# EAGLE design OSO-SCAP-A1-02 SAMD51 Sensor Cap (EAGLE 9.4.2)

## Sheet 1 of 2
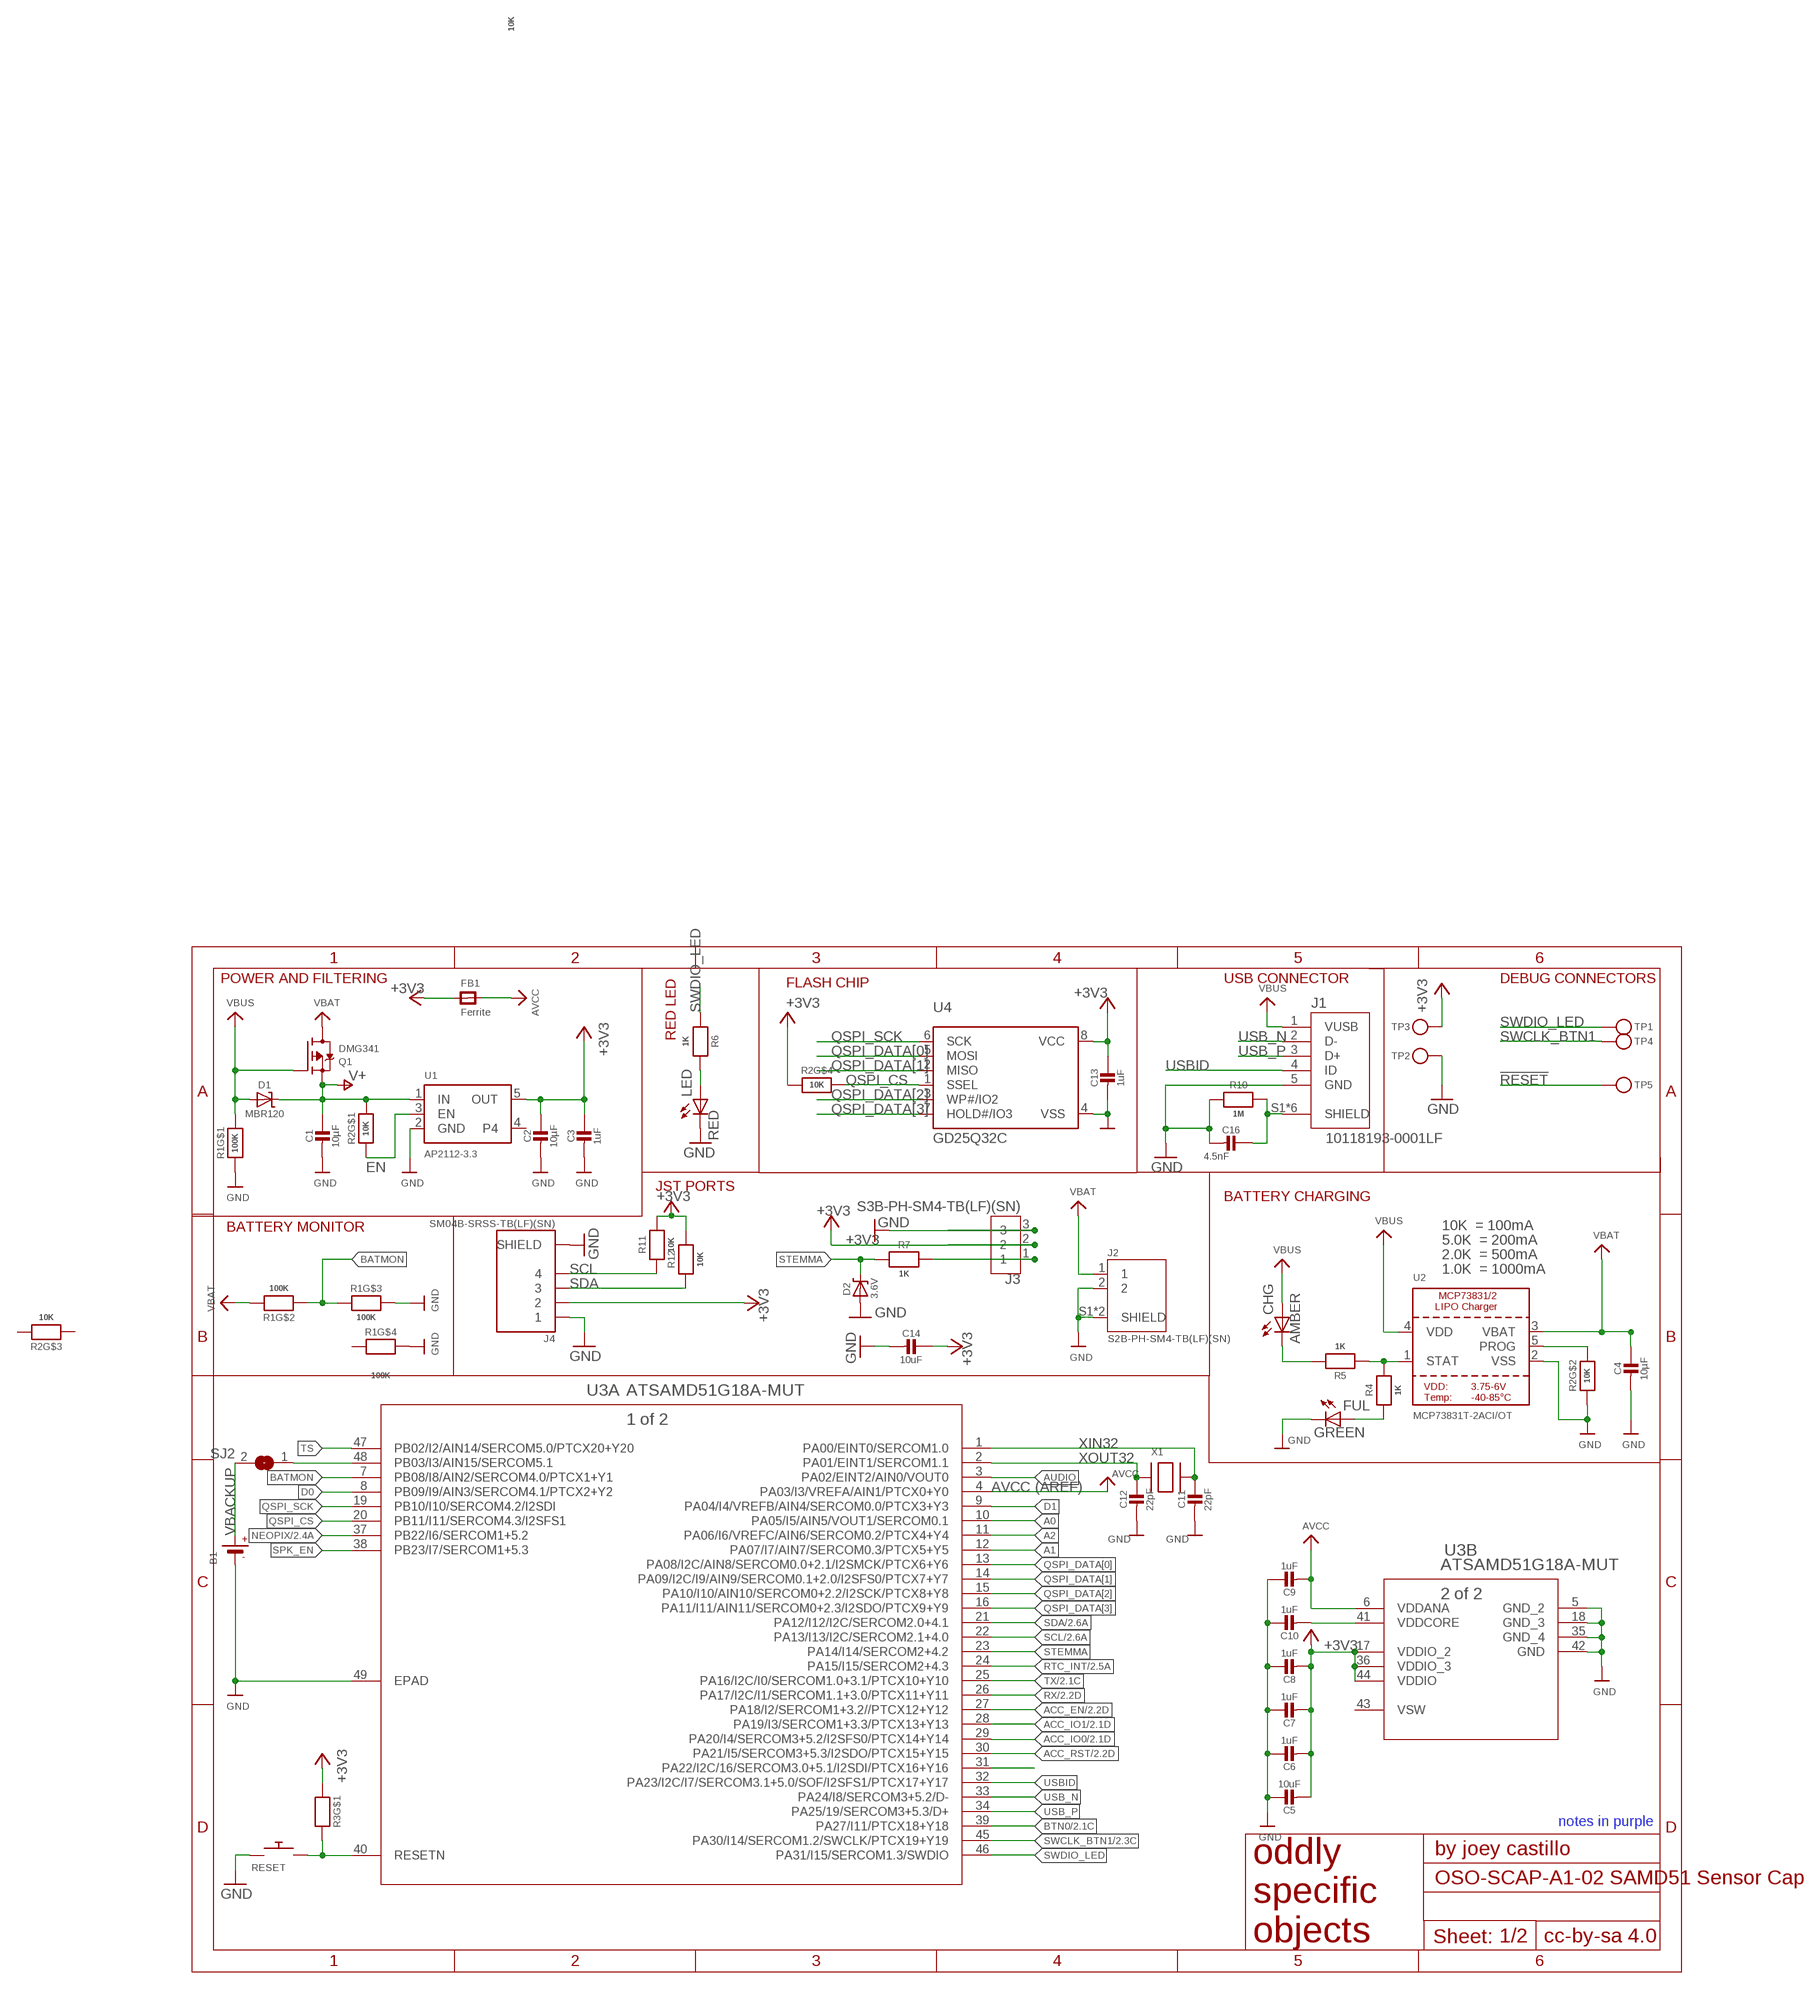
[diagram p0: schematic, sheet 1]

### Parts
B1  CR1220  BATTERYCR1220_2  [CR1220-2]
C1  10µF  CAP_CERAMIC0805-NOOUTLINE  [0805-NO]
C2  10µF  CAP_CERAMIC0805-NOOUTLINE  [0805-NO]
C3  1uF  CAP_CERAMIC0603_NO  [0603-NO]
C4  10µF  CAP_CERAMIC0805-NOOUTLINE  [0805-NO]
C5  10uF  CAP_CERAMIC0805_10MGAP  [0805_10MGAP]
C6  1uF  CAP_CERAMIC0603_NO  [0603-NO]
C7  1uF  CAP_CERAMIC0603_NO  [0603-NO]
C8  1uF  CAP_CERAMIC0603_NO  [0603-NO]
C9  1uF  CAP_CERAMIC0603_NO  [0603-NO]
C10  1uF  CAP_CERAMIC0603_NO  [0603-NO]
C11  22pF  CAP_CERAMIC0603_NO  [0603-NO]
C12  22pF  CAP_CERAMIC0603_NO  [0603-NO]
C13  1uF  CAP_CERAMIC0603_NO  [0603-NO]
C14  10uF  CAP_CERAMIC0805-NOOUTLINE  [0805-NO]
C16  4.5nF  CAP_CERAMIC0603_NO  [0603-NO]
CHG  AMBER  LEDCHIPLED_0603  [CHIPLED_0603]
D1  MBR120  DIODE-SCHOTTKYSOD-123  [SOD-123]
D2  3.6V  DIODE-ZENERSOD123  [SOD-123]
FB1  Ferrite  FERRITE_0805MP  [_0805MP]
FUL  GREEN  LEDCHIPLED_0603  [CHIPLED_0603]
J1  10118193-0001LF  [FCI_10118193-0001LF]
J2  S2B-PH-SM4-TB(LF)(SN)  [JST_S2B-PH-SM4-TB(LF)(SN)]
J3  S3B-PH-SM4-TB(LF)(SN)  [JST_S3B-PH-SM4-TB(LF)(SN)]
J4  SM04B-SRSS-TB(LF)(SN)  [JST_SM04B-SRSS-TB(LF)(SN)]
LED  RED  LEDCHIPLED_0603  [CHIPLED_0603]
Q1  DMG341  MOSFET-P  [SOT23-R]
R1  100K  EXB-V8V103JV-GOOD  [EXBV8V]
R2  10K  EXB-V8V103JV-GOOD  [EXBV8V]
R3  10K  EXB-V8V103JV-GOOD  [EXBV8V]
R4  1K  RESISTOR_0603_NOOUT  [0603-NO]
R5  1K  RESISTOR_0603_NOOUT  [0603-NO]
R6  1K  RESISTOR_0603_NOOUT  [0603-NO]
R7  1K  RESISTOR_0603_NOOUT  [0603-NO]
R10  1M  RESISTOR_0603_NOOUT  [0603-NO]
R11  10K  RESISTOR_0603_NOOUT  [0603-NO]
R12  10K  RESISTOR_0603_NOOUT  [0603-NO]
RESET  SWITCH_PUSHBUTTONC&K_KSS  [BTN_CK_KSS]
SJ2  SOLDERJUMPERREFLOW_NOPASTE  [SOLDERJUMPER_REFLOW_NOPASTE]
TP1  TESTPOINTROUND1.5MMNO  [TESTPOINT_ROUND_1.5MM_NO]
TP2  TESTPOINTROUND1.5MMNO  [TESTPOINT_ROUND_1.5MM_NO]
TP3  TESTPOINTROUND1.5MMNO  [TESTPOINT_ROUND_1.5MM_NO]
TP4  TESTPOINTROUND1.5MMNO  [TESTPOINT_ROUND_1.5MM_NO]
TP5  TESTPOINTROUND1.5MMNO  [TESTPOINT_ROUND_1.5MM_NO]
U1  AP2112-3.3  VREG_SOT23-5  [SOT23-5]
U2  MCP73831T-2ACI/OT  MCP73831/2  [SOT23-5]
U3  ATSAMD51G18A-MUT  [QFN48_7X7MC]
U4  GD25Q32C  MICROBUILDER_SPIFLASH_SOIC8  [MICROBUILDER_SOIC8_150MIL]
X1  XTAL-3.2X1.5  [XTAL3215]

### Nets
!RESET: R3.8 RESET.P$2 TP5.P$1 U3.40(A:RESETN)
+3V3 [power]: C2.1 C3.1 C5.2 C6.2 C7.2 C8.2 C13.1 C14.1 FB1.1 J3.2 J4.2 R2.4 R3.1 R11.2 R12.2 TP3.P$1 U1.5(OUT) U3.17(B:VDDIO_2) U3.36(B:VDDIO_3) U3.44(B:VDDIO) U4.8(VCC) ; also sheet 2
_STEMMA: J3.1 R7.1
_VBACKUP: SJ2.1 U3.48(A:PB03/I3/AIN15/SERCOM5.1)
A0: U3.10(A:PA05/I5/AIN5/VOUT1/SERCOM0.1) ; also sheet 2
A1: U3.12(A:PA07/I7/AIN7/SERCOM0.3/PTCX5+Y5) ; also sheet 2
A2: U3.11(A:PA06/I6/VREFC/AIN6/SERCOM0.2/PTCX4+Y4) ; also sheet 2
ACC_EN: U3.27(A:PA18/I2/SERCOM1+3.2//PTCX12+Y12) ; also sheet 2
ACC_IO0: U3.29(A:PA20/I4/SERCOM3+5.2/I2SFS0/PTCX14+Y14) ; also sheet 2
ACC_IO1: U3.28(A:PA19/I3/SERCOM1+3.3/PTCX13+Y13) ; also sheet 2
ACC_RST: U3.30(A:PA21/I5/SERCOM3+5.3/I2SDO/PTCX15+Y15) ; also sheet 2
AUDIO: U3.3(A:PA02/EINT2/AIN0/VOUT0) ; also sheet 2
AVCC: C9.2 FB1.2 U3.4(A:PA03/I3/VREFA/AIN1/PTCX0+Y0) U3.6(B:VDDANA) ; also sheet 2
BATMON: R1.2 R1.3 U3.7(A:PB08/I8/AIN2/SERCOM4.0/PTCX1+Y1)
BTN0: U3.39(A:PA27/I11/PTCX18+Y18) ; also sheet 2
D0: U3.8(A:PB09/I9/AIN3/SERCOM4.1/PTCX2+Y2) ; also sheet 2
D1: U3.9(A:PA04/I4/VREFB/AIN4/SERCOM0.0/PTCX3+Y3) ; also sheet 2
EN: R2.1 U1.3(EN) ; also sheet 2
GND [gnd]: B1.- C1.2 C2.2 C3.2 C4.2 C5.1 C6.1 C7.1 C8.1 C9.1 C10.1 C11.2 C12.2 C13.2 C14.2 C16.2 D2.A FUL.C J1.5(GND) J2.2 J2.S1(SHIELD) J2.S2(SHIELD) J3.3 J4.1 J4.S1(SHIELD) J4.S2(SHIELD) LED.C R1.1 R1.5 R1.6 R2.2 R10.2 RESET.P$1 TP2.P$1 U1.2(GND) U2.2(VSS) U3.5(B:GND_2) U3.18(B:GND_3) U3.35(B:GND_4) U3.42(B:GND) U3.49(A:EPAD) U4.4(VSS) ; also sheet 2
N$2: LED.A R6.2
N$5: U3.31(A:PA22/I2C/16/SERCOM3.0+5.1/I2SDI/PTCX16+Y16)
N$6: CHG.C R5.2
N$7: FUL.A R4.1
NEOPIX: U3.37(A:PB22/I6/SERCOM1+5.2) ; also sheet 2
PROG: R2.7 U2.5(PROG)
QSPI_CS: R2.5 U3.20(A:PB11/I11/SERCOM4.3/I2SFS1) U4.1(SSEL)
QSPI_DATA[0]: U3.13(A:PA08/I2C/AIN8/SERCOM0.0+2.1/I2SMCK/PTCX6+Y6) U4.5(MOSI)
QSPI_DATA[1]: U3.14(A:PA09/I2C/I9/AIN9/SERCOM0.1+2.0/I2SFS0/PTCX7+Y7) U4.2(MISO)
QSPI_DATA[2]: U3.15(A:PA10/I10/AIN10/SERCOM0+2.2/I2SCK/PTCX8+Y8) U4.3(WP#/IO2)
QSPI_DATA[3]: U3.16(A:PA11/I11/AIN11/SERCOM0+2.3/I2SDO/PTCX9+Y9) U4.7(HOLD#/IO3)
QSPI_SCK: U3.19(A:PB10/I10/SERCOM4.2/I2SDI) U4.6(SCK)
RTC_INT: U3.24(A:PA15/I15/SERCOM2+4.3) ; also sheet 2
RX: U3.26(A:PA17/I2C/I1/SERCOM1.1+3.0/PTCX11+Y11) ; also sheet 2
SCL: J4.4 R11.1 U3.22(A:PA13/I13/I2C/SERCOM2.1+4.0) ; also sheet 2
SDA: J4.3 R12.1 U3.21(A:PA12/I12/I2C/SERCOM2.0+4.1) ; also sheet 2
SHIELD [gnd]: C16.1 J1.S1(SHIELD) J1.S2(SHIELD) J1.S3(SHIELD) J1.S4(SHIELD) J1.S5(SHIELD) J1.S6(SHIELD) R10.1
SPK_EN: U3.38(A:PB23/I7/SERCOM1+5.3) ; also sheet 2
STAT: R4.2 R5.1 U2.1(STAT)
STEMMA: D2.C R7.2 U3.23(A:PA14/I14/SERCOM2+4.2)
SWCLK_BTN1: TP4.P$1 U3.45(A:PA30/I14/SERCOM1.2/SWCLK/PTCX19+Y19) ; also sheet 2
SWDIO_LED: R6.1 TP1.P$1 U3.46(A:PA31/I15/SERCOM1.3/SWDIO)
TS: U3.47(A:PB02/I2/AIN14/SERCOM5.0/PTCX20+Y20) ; also sheet 2
TX: U3.25(A:PA16/I2C/I0/SERCOM1.0+3.1/PTCX10+Y10) ; also sheet 2
USB_N: J1.2(D-) U3.33(A:PA24/I8/SERCOM3+5.2/D-)
USB_P: J1.3(D+) U3.34(A:PA25/19/SERCOM3+5.3/D+)
USBID: J1.4(ID) U3.32(A:PA23/I2C/I7/SERCOM3.1+5.0/SOF/I2SFS1/PTCX17+Y17)
V+ [power]: C1.1 D1.C Q1.2(S) R2.8 U1.1(IN) ; also sheet 2
VBACKUP: B1.+ SJ2.2 ; also sheet 2
VBAT [power]: C4.1 J2.1 Q1.3(D) R1.7 U2.3(VBAT)
VBUS [power]: CHG.A D1.A J1.1(VUSB) Q1.1(G) R1.8 U2.4(VDD)
VDDCORE: C10.2 U3.41(B:VDDCORE)
XIN32: C11.1 U3.1(A:PA00/EINT0/SERCOM1.0) X1.P$2
XOUT32: C12.1 U3.2(A:PA01/EINT1/SERCOM1.1) X1.P$1
Unconnected: R1.4 R2.3 R2.6 U1.4

### Notes on the sheet
- RED LED
- POWER AND FILTERING | USB CONNECTOR | DEBUG CONNECTORS
- FLASH CHIP
- JST PORTS
- BATTERY CHARGING
- BATTERY MONITOR | 10K  = 100mA
- 5.0K  = 200mA
- 2.0K  = 500mA
- 1.0K  = 1000mA
- (AREF)
- notes in purple

## Sheet 2 of 2
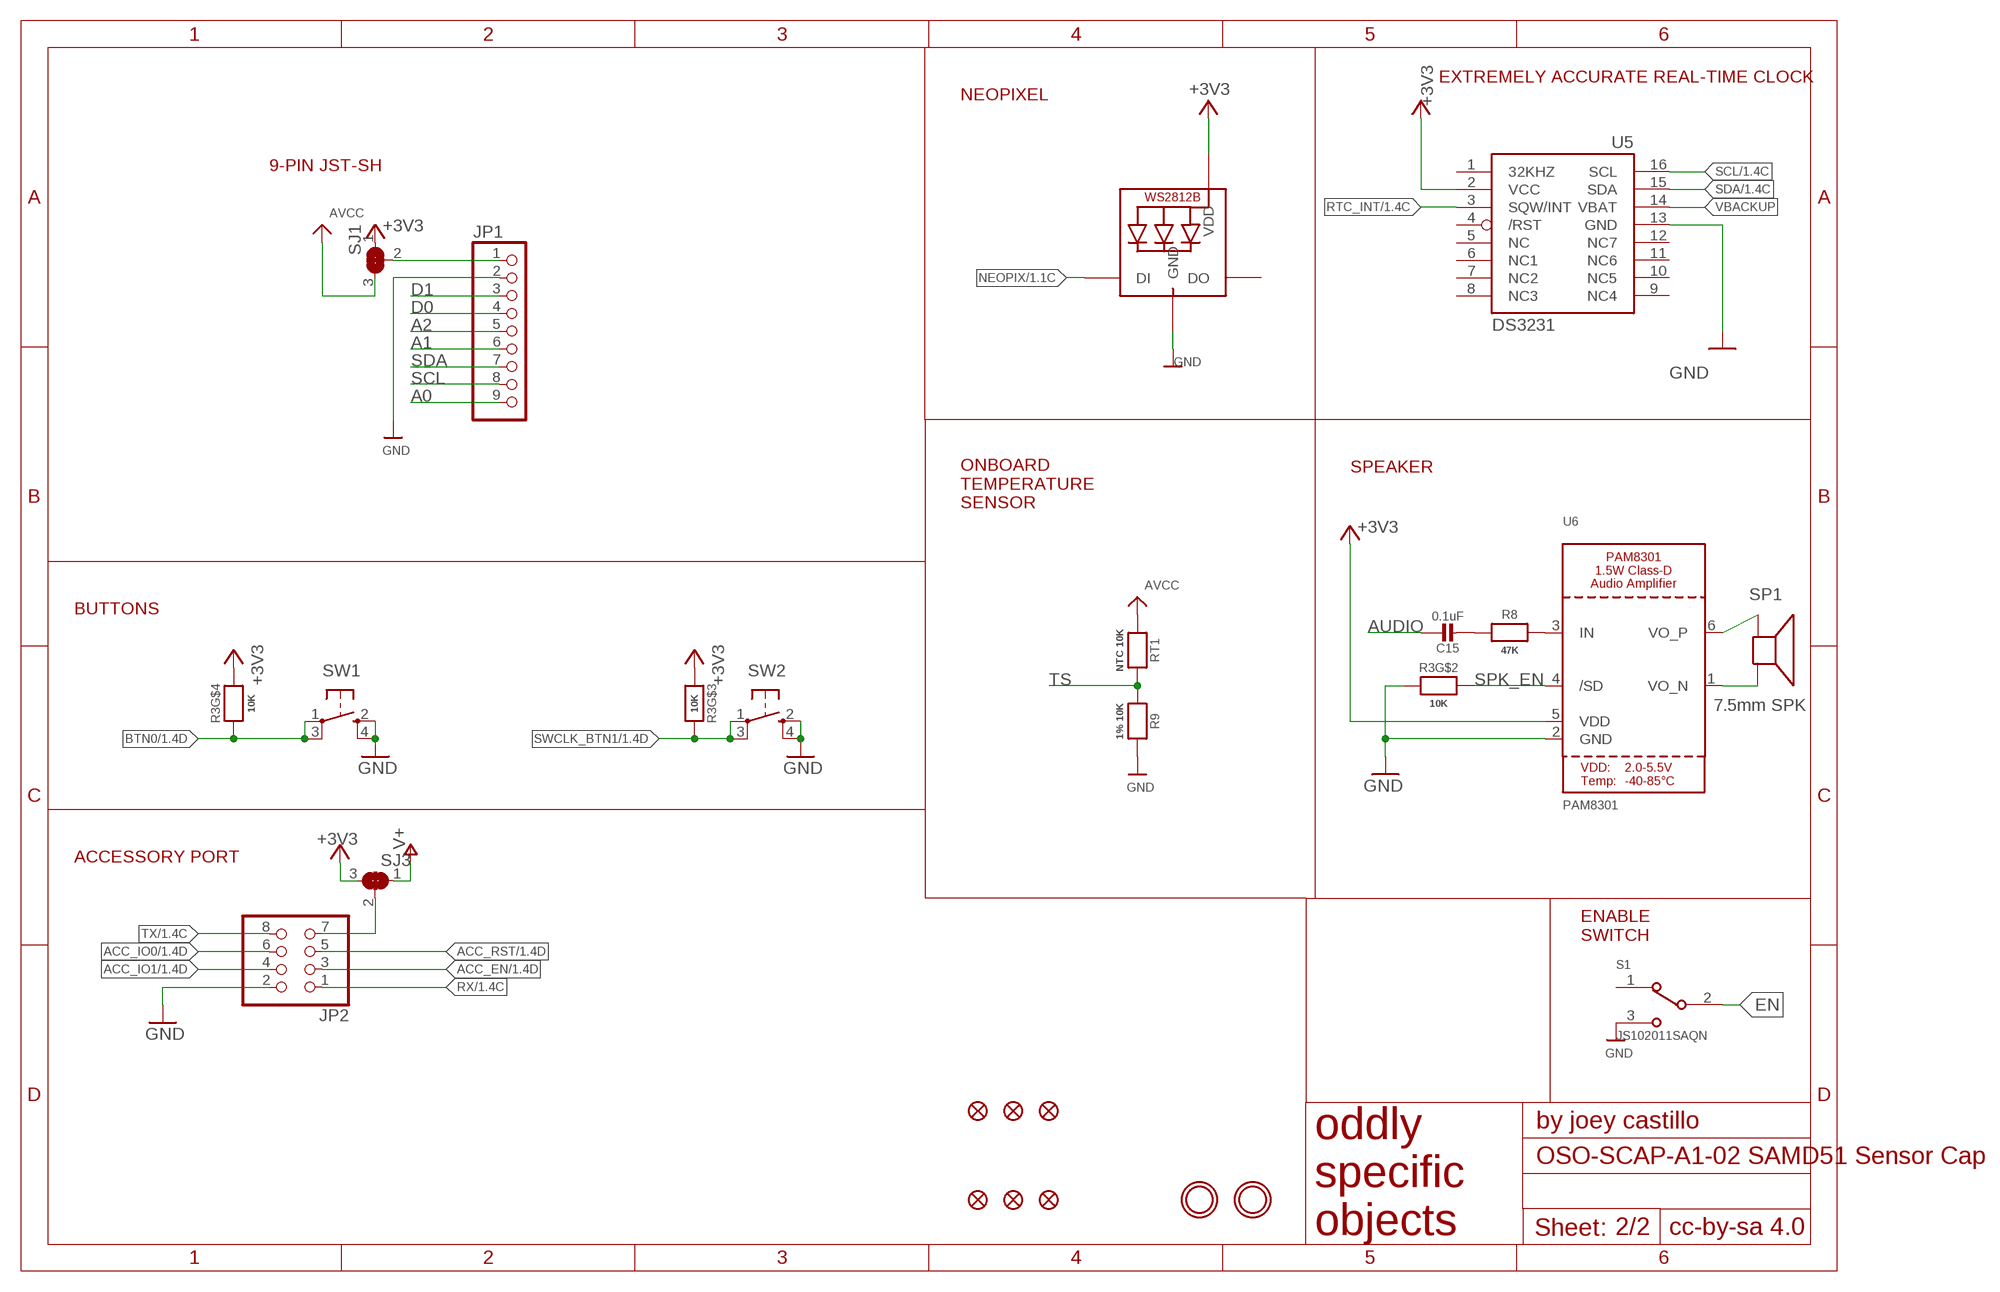
[diagram p1: schematic, sheet 2]

### Parts
C15  0.1uF  CAP_CERAMIC0603_NO  [0603-NO]
FID1  FIDUCIAL_1MM  [FIDUCIAL_1MM]
FID2  FIDUCIAL_1MM  [FIDUCIAL_1MM]
FID3  FIDUCIAL_1MM  [FIDUCIAL_1MM]
FID4  FIDUCIAL_1MM  [FIDUCIAL_1MM]
FID5  FIDUCIAL_1MM  [FIDUCIAL_1MM]
FID6  FIDUCIAL_1MM  [FIDUCIAL_1MM]
JP1  HEADER-1X9_JSTSH  [JST_SH9]
JP2  PINHD-2X4SMT  [PINHD_2X4_SMT]
NEOPIX  WS2812B_4020  [WS2812B_4020]
R8  47K  RESISTOR_0603_NOOUT  [0603-NO]
R9  1% 10K  RESISTOR0805_NOOUTLINE  [0805-NO]
RT1  NTC 10K  RESISTOR0805_NOOUTLINE  [0805-NO]
S1  JS102011SAQN  [SW_JS102011SAQN]
SJ1  SOLDERJUMPER_2WAY  [SOLDERJUMPER_2WAY_OPEN_NOPASTE]
SJ3  SOLDERJUMPER_2WAY  [SOLDERJUMPER_2WAY_OPEN_NOPASTE]
SP1  7.5mm SPK  SPEAKER_BUZZER5MM  [BUZZER_SMT_5MM]
SW1  SPST_TACT-KMR2  [KMR2]
SW2  SPST_TACT-KMR2  [KMR2]
U5  DS3231/SO  [SO16W]
U6  PAM8301  [SOT23-6]
U$1  MOUNTINGHOLE2.5  [MOUNTINGHOLE_2.5_PLATED]
U$4  MOUNTINGHOLE2.5  [MOUNTINGHOLE_2.5_PLATED]

### Nets
+3V3 [power]: NEOPIX.2(VDD) R3.3 R3.5 SJ1.1 SJ3.3 U5.2(VCC) U6.5(VDD) ; also sheet 1
A0: JP1.9 ; also sheet 1
A1: JP1.6 ; also sheet 1
A2: JP1.5 ; also sheet 1
ACC_EN: JP2.3 ; also sheet 1
ACC_IO0: JP2.6 ; also sheet 1
ACC_IO1: JP2.4 ; also sheet 1
ACC_POWER [power]: JP2.7 SJ3.2
ACC_RST: JP2.5 ; also sheet 1
AUDIO: C15.1 ; also sheet 1
AVCC: RT1.1 SJ1.3 ; also sheet 1
BTN0: R3.4 SW1.1(P) SW1.3(P1) ; also sheet 1
D0: JP1.4 ; also sheet 1
D1: JP1.3 ; also sheet 1
EN: S1.2 ; also sheet 1
GND [gnd]: JP1.2 JP2.2 NEOPIX.4(GND) R3.2 R9.2 S1.3 SW1.2(S) SW1.4(S1) SW2.2(S) SW2.4(S1) U5.13(GND) U6.2(GND) ; also sheet 1
N$3: C15.2 R8.1
N$4: R8.2 U6.3(IN)
NEOPIX: NEOPIX.1(DI) ; also sheet 1
POWER_OUT [power]: JP1.1 SJ1.2
RTC_INT: U5.3(SQW/INT) ; also sheet 1
RX: JP2.1 ; also sheet 1
SCL: JP1.8 U5.16(SCL) ; also sheet 1
SDA: JP1.7 U5.15(SDA) ; also sheet 1
SPK_EN: R3.7 U6.4(/SD) ; also sheet 1
SPK_N: SP1.+ U6.1(VO_N)
SPK_P: SP1.- U6.6(VO_P)
SWCLK_BTN1: R3.6 SW2.1(P) SW2.3(P1) ; also sheet 1
TS: R9.1 RT1.2 ; also sheet 1
TX: JP2.8 ; also sheet 1
V+ [power]: SJ3.1 ; also sheet 1
VBACKUP: U5.14(VBAT) ; also sheet 1
Unconnected: NEOPIX.3(DO) S1.1 U5.1(32KHZ) U5.4(/RST) U5.5(NC) U5.6(NC1) U5.7(NC2) U5.8(NC3) U5.9(NC4) U5.10(NC5) U5.11(NC6) U5.12(NC7)

### Notes on the sheet
- EXTREMELY ACCURATE REAL-TIME CLOCK
- NEOPIXEL
- 9-PIN JST-SH
- SPEAKER
- ONBOARD
  TEMPERATURE
  SENSOR
- BUTTONS
- ACCESSORY PORT
- ENABLE
  SWITCH

## Power pins joined to a net without a drawn wire
VSW: U3.43(B:VSW)

## Library data of the parts
B1 = microbuilder:BATTERY: CR1220 SMT - Digikey: 3001K-ND CD2032 BAT-HLD-001 - Digikey: BAT-HLD-001-ND
C1-C16 = microbuilder:CAP_CERAMIC: Ceramic Capacitors For new designs, use the packages preceded by an '_' character since they are more reliable: The following footprints should be used on most boards: _0402 - Standard footprint for regular board layouts _0603 - Standard footprint for regular board layouts _0805 - Standard footprint for regular board layouts _1206 - Standard footprint for regular board layouts For extremely tight-pitch boards where space is at a premium, the following 'micro-pitch' footprints can be used (smaller pads, no silkscreen outline, etc.): _0402MP - Micro-pitch footprint for very dense/compact boards _0603MP - Micro-pitch footprint for very dense/compact boards _0805MP - Micro-pitch footprint for very dense/compact boards _1206MP - Micro-pitch footprint for very dense/compact boards
CHG FUL LED = adafruit:LED: LED OSRAM: - CHIPLED LG R971, LG N971, LY N971, LG Q971, LY Q971, LO R971, LY R971 LH N974, LH R974 LS Q976, LO Q976, LY Q976 LO Q996 - Hyper CHIPLED LW Q18S LB Q993, LB Q99A, LB R99A - SideLED LS A670, LO A670, LY A670, LG A670, LP A670 LB A673, LV A673, LT A673, LW A673 LH A674 LY A675 LS A676, LA A676, LO A676, LY A676, LW A676 LS A679, LY A679, LG A679 - Hyper Micro SIDELED® LS Y876, LA Y876, LO Y876, LY Y876 LT Y87S - SmartLED LW L88C, LW L88S LB L89C, LB L89S, LG L890 LS L89K, LO L89K, LY L89K LS L896, LA L896, LO L896, LY L896 - TOPLED LS T670, LO T670, LY T670, LG T670, LP T670 LSG T670, LSP T670, LSY T670, LOP T670, LYG T670 LG T671, LOG T671, LSG T671 LB T673, LV T673, LT T673, LW T673 LH T674 LS T676, LA T676, LO T676, LY T676, LB T676, LH T676, LSB T676, LW T676 LB T67C, LV T67C, LT T67C, LS T67K, LO T67K, LY T67K, LW E67C LS E67B, LA E67B, LO E67B, LY E67B, LB E67C, LV E67C, LT E67C LW T67C LS T679, LY T679, LG T679 LS T770, LO T770, LY T770, LG T770, LP T770 LB T773, LV T773, LT T773, LW T773 LH T774 LS E675, LA E675, LY E675, LS T675 LS T776, LA T776, LO T776, LY T776, LB T776 LHGB T686 LT T68C, LB T68C - Hyper Mini TOPLED® LB M676 - Mini TOPLED Santana® LG M470 LS M47K, LO M47K, LY M47K Source: http://www.osram.convergy.de/
D1 = microbuilder:DIODE-SCHOTTKY
D2 = microbuilder:DIODE-ZENER: Zener Diode SMA: 30V 1W Zener Diode, 1.2Vf - Digikey: SMAZ30-FDICT-ND
FB1 = microbuilder:FERRITE: Ferrite Bead 0603 MMZ1608B121C - 120 Ohm @ 100MHz, 600mA, 0.15 Ohm DC Resistance - Digikey: 445-2164-1-ND BK1608HW121-T - 120 Ohm, 600mA Ferrite Chip - Digikey: 587-1876-2-ND 0805 HZ0805B272R-10 - 2.7K Ohm @ 100MHz, 200mA, 0.8 Ohm DC Resistance - Digikey: 240-2504-1-ND (see also Murata BLM21BD272SN1L) MMZ2012Y152B - 1.5K Ohm @ 100MHz, 500mA, 0.4 Ohm DC Resistance - Digikey: 445-1560-1-ND - Mainly for high frequency (80-400MHz) MMZ2012R102A - 1K Ohm @ 100MHz, 500mA, 0.3 Ohm DC Resistance - Digikey: 445-1555-2-ND - More general purpose (10-200MHz)
FID1-FID6 = microbuilder:FIDUCIAL: Fiducial Alignment Points Various fiducial points for machine vision alignment.; BOM: EXCLUDE
J1 = 10118193-0001LF:10118193-0001LF: Micro USB B Type Receptacle; DESCRIPTION: Single Port 5 Contact Shielded SMT MICRO USB B-Type Receptacle; DIGI-KEY_PART_NUMBER: 609-4616-1-ND; DIGI-KEY_PURCHASE_URL: https://www.digikey.com/product-detail/en/amphenol-icc-fci/10118193-0001LF/609-4616-1-ND/2785380?utm_source=snapeda&utm_medium=aggregator&utm_campaign=symbol; MF: Amphenol ICC; MP: 10118193-0001LF; PACKAGE: None
J2 = S2B-PH-SM4-TB_LF__SN_:S2B-PH-SM4-TB(LF)(SN): PH Series 2 Position 2 mm Pitch Surface Mount Side Entry Shrouded Header; DESCRIPTION: Connector Header Surface Mount, Right Angle 2 position 0.079 _2.00mm_; DIGI-KEY_PART_NUMBER: 455-1749-1-ND; DIGI-KEY_PURCHASE_URL: https://www.digikey.com/product-detail/en/jst-sales-america-inc/S2B-PH-SM4-TB_LF__SN_/455-1749-1-ND/926846?utm_source=snapeda&utm_medium=aggregator&utm_campaign=symbol; MF: JST Sales; MP: S2B-PH-SM4-TB_LF__SN_; PACKAGE: None
J3 = S3B-PH-SM4-TB_LF__SN_:S3B-PH-SM4-TB(LF)(SN): CONN HEADER PH SIDE 3POS 2MM SMD; DESCRIPTION: Connector Header Surface Mount, Right Angle 3 position 0.079 _2.00mm_; DIGI-KEY_PART_NUMBER: 455-1750-1-ND; DIGI-KEY_PURCHASE_URL: https://www.digikey.com/product-detail/en/jst-sales-america-inc/S3B-PH-SM4-TB_LF__SN_/455-1750-1-ND/926847?utm_source=snapeda&utm_medium=aggregator&utm_campaign=symbol; MF: JST Sales; MP: S3B-PH-SM4-TB_LF__SN_; PACKAGE: None
J4 = SM04B-SRSS-TB_LF__SN_:SM04B-SRSS-TB(LF)(SN): SH Series 1.0 mm Pitch 2 Position Single Row Side Entry Shrouded Header; DESCRIPTION: SH Series 1.0 mm Pitch 2 Position Single Row Side Entry Shrouded Header; DIGI-KEY_PART_NUMBER: 455-1804-1-ND; DIGI-KEY_PURCHASE_URL: https://www.digikey.com/product-detail/en/jst-sales-america-inc/SM04B-SRSS-TB_LF__SN_/455-1804-1-ND/926875?utm_source=snapeda&utm_medium=aggregator&utm_campaign=symbol; MF: JST Sales; MP: SM04B-SRSS-TB_LF__SN_; PACKAGE: None
JP1 = microbuilder:HEADER-1X9: PIN HEADER
JP2 = My Stuff:PINHD-2X4: PIN HEADER
NEOPIX = microbuilder:WS2812B
Q1 = microbuilder:MOSFET-P: P-Channel Mosfet LEGEND VDS: Voltage Drain-Source ID: Drain Current RDS(ON): Drain-Source On-State Resistance VGS(TH): Gate-Source Threshold Voltage CISS: Drain-Source Input Capacitance SOT-23 Name VDS ID RDS(ON) VGS(TH) CISS Order Number IRLML5103 30V 760mA 600 mOhm -- 75pF @ 25V Digikey: IRLML5103PBFCT-ND IRLML6401 12V 4.3A 50 mOhm 950mV @ 250µA 830pF @ 10V Digikey: IRLML6401PBFTR-ND NTR0202PL 20V 400mA 800 mOhm 2.3V @ 250uA 70pF @ 5V Digikey: NTR0202PLT1GOSTR-ND NTR4101PT1G 20V 1.8A 85 mOhm 1.2V @ 250uA 675pF @ 10V Digikey: NTR4101PT1GOSCT-ND DMP2004K 20V 600mA 900 mOhm 1V @ 250uA 175pF @ 16V Digikey: DMP2004KDICT-ND PMV65XP 20V 3.9A 76 mOhm 950mV @ 1mA 725pF @ 20V Digikey: 568-2358-2-ND TO-252 Name VDS ID RDS(ON) VGS(TH) CISS Order Number AOD417 30V 25A 34 mOhm 3V @ 250µA 920pF @ 15V Digikey: 785-1106-2-ND PowerPak Name VDS ID RDS(ON) VGS(TH) CISS Order Number AON7401 30V 12A 14 mOhm 3V @ 250µA 2600pF @ 15V Digikey: 785-1302-1-ND
R1-R3 = resistor array:EXB-V8V103JV-GOOD; MANUFACTURER_PART_NUMBER: EXBV8V103JV; VENDOR: Panasonic
R4-R12 RT1 = microbuilder:RESISTOR: Resistors For new designs, use the packages preceded by an '_' character since they are more reliable: The following footprints should be used on most boards: _0402 - Standard footprint for regular board layouts _0603 - Standard footprint for regular board layouts _0805 - Standard footprint for regular board layouts _1206 - Standard footprint for regular board layouts For extremely tight-pitch boards where space is at a premium, the following 'micro-pitch' footprints can be used (smaller pads, no silkscreen outline, etc.): _0402MP - Micro-pitch footprint for very dense/compact boards _0603MP - Micro-pitch footprint for very dense/compact boards _0805MP - Micro-pitch footprint for very dense/compact boards _1206MP - Micro-pitch footprint for very dense/compact boards
RESET = adafruit:SWITCH_PUSHBUTTON: Buttons SOFTTOUCHSMD_SJ - Soft touch temporary push button (Super Junk Akihabara) Compatible with SKPMANE010 [Mouser: 688-SKPMAN] C&K_KSS = Digikey: KSS221GLFS
S1 = JS102011SAQN:JS102011SAQN: JS10 Series SPDT On-On 6 V 0.3 A Gull Wing SMT Slide Switch http://www.snapeda.com/parts/JS102011SAQN/C%26K%20Components/view-part/; DESCRIPTION: Slide Switch SPDT Surface Mount, Right Angle; DIGI-KEY_PART_NUMBER: 401-1999-1-ND; DIGI-KEY_PURCHASE_URL: https://www.digikey.com/product-detail/en/c-k/JS102011SAQN/401-1999-1-ND/1640114?utm_source=snapeda&utm_medium=aggregator&utm_campaign=symbol; MF: C&K; MP: JS102011SAQN; PACKAGE: None
SJ1 SJ3 = pygamer-microbuilder:SOLDERJUMPER_2WAY: 2-Way Solder Jumper
SJ2 = microbuilder:SOLDERJUMPER: SMD Solder JUMPER Solder the two pads together to create a connection, or remove the solder to break it. REFLOW - Use this footprint for solder paste and reflow ovens. WAVE - Use this footprint for hand-soldering (larger pads). CLOSED - Has a trace between the two pads to ensure it is closed by default. The trace needs to be cut to disable the jumper, and can be closed again by creating a solder bridge between the two pads.
SP1 = microbuilder:SPEAKER: SPEAKER Source: Buerklin Added PS12 (for part # PS1240 piezo) http://www.ladyada.net/library/pcb/eaglelibrary.html
SW1 SW2 = adafruit:SPST_TACT: SMT 6mm switch, EVQQ2 series http://www.ladyada.net/library/eagle
TP1-TP5 = microbuilder:TESTPOINT: Test Point Various test points for characterisation and PCB testing TESTPOINT_SMT - Compact Surface Mount Test Point [Digikey: 5016KTR-ND]
U1 = microbuilder:VREG_SOT23-5: SOT23-5 Fixed Voltage Regulators Part Current Out V Out V In V Dropout θJA (°C/W) TJ (°C) Digikey Part No. ADP121 150mA 3.3V 3.4-5.5V 0.09V @ 150mA -- -- ADP121-AUJZ33R7CT-ND ADP121 150mA 3.0V 3.1-5.5V 0.09V @ 150mA -- -- ADP121-AUJZ30R7CT-ND ADP122 300mA 3.3V 3.4-5.5V 0.085V @ 300mA -- -- ADP122AUJZ-3.3-R7CT-ND ADP1712 300mA 3.3V 3.5-5.5V 0.17V @ 300mA -- -- ADP1712AUJZ-3.3-R7TR-ND AP7311 (Low Cost) 150mA 3.3V 3.5-6V 0.15V @ 150mA -- -- AP7311-33WG-7DICT-ND LD39015M18R 150mA 1.8V 1.9V-5.5V 0.08V @ 100mA -- -- 497-6977-1-ND LP2985A-33DBVR 150mA 3.3V 3.3-16V 0.28V @ 150mA 206 150 296-18479-1-ND MCP1824T-3302E/OT 300mA 3.3V 3.5V-6V 0.2V @ 300mA -- -- MCP1824T-3302E/OTCT-ND MIC5205-2.5YM5 TR 150mA 2.5V 2.7-16V 0.165V @ 150mA -- -- 576-1257-2-ND MIC5205-3.0YM5 TR 150mA 3.0V 3.2V-16V 0.165V @ 150mA -- -- 576-1258-2-ND MIC5205-3.3YM5 TR 150mA 3.3V 3.5V-16V 0.165V @ 150mA -- -- 576-1259-2-ND TPS780330220 150mA 3.3V+2.2V 3.6-5.5V 250mV Max -- -- 296-23332-1-ND TDA3663/N1,135 100mA 3.3V 3.5-45V 0.18V @ 50mA -- -- 568-5343-1-ND Max operating temp can be calculated using θJA, TJ (max junction temperature), and power in watts. Set the "Maximum Ambient Temperature" until it reaches TJ ("Max Junction Temperature"), which is the absolute limit for safe use of the regulator: Heat Sink Temperature Calculator <http://www.daycounter.com/Calculators/Heat-Sink-Temperature-Calculator.phtml> For example, With 12V source into a 3.3V LP2985 and a 30mA load, we are dissipating (12V-3.3V) * 0.03A = 0.261W. With a θJA of 206 °C/W, a TJ of 150°C, and 261mW we can safely use the chip without a heat sink up to 75°C (=147.1°C Junction Temperature).
U2 = microbuilder:MCP73831/2: MCP73831/2 LIPO Charger VDD: 3.75 - 6V Temp -40 - 85°C Programmable Charge Rate: 15-500mA NOTE: STAT is a tri-state logic output on the MCP73831 and an open-drain output on the MCP73832. SOT23-5 with 4.2V output and tri-state logic on STAT = MCP73831T-2ACI/OT
U3 = ATSAMD51G18AMUT:ATSAMD51G18A-MUT; BUILT_BY: EMA_Molly; COPYRIGHT: Copyright (C) 2018 Accelerated Designs. All rights reserved; MANUFACTURER_PART_NUMBER: ATSAMD51G18A-MUT; VENDOR: Microchip
U4 = Adafruit Feather M0 Express:MICROBUILDER_SPIFLASH_SOIC8: SOIC8 SPI Flash Be careful with the size since SOIC8 flash comes in several 'widths' SOIC8 150 mil M25P16 - 16Mbit (2Mbit x 8) Serial Flash (75MHz SPI Bus), Supply: 2.7-3.6V Digikey: SOIC8 - M25P16-VMN6P-ND SOIC8 208 mil W25Q16BVSSIG - 16Mbit (2Mbit x 8) Serial Flash (104MHz SPI Bus), Supply: 2.7-3.6V Digikey: SOIC8 - W25Q16BVSSIG-ND
U5 = adafruit:DS3231
U6 = microbuilder:PAM8301
U$1 U$4 = microbuilder:MOUNTINGHOLE: Mounting Hole For #2 screws (0.086"/2.18mm width, 0.094"/2.4mm hole) use 2.5mm; BOM: EXCLUDE
X1 = adafruit:XTAL: Low cost SMT crystals, no capacitors included http://www.ladyada.net/library/eagle

## Net classes
1 power: width 0.305 mm, drill 0.305 mm
2 gnd: width 0.254 mm, drill 0.254 mm

## Board
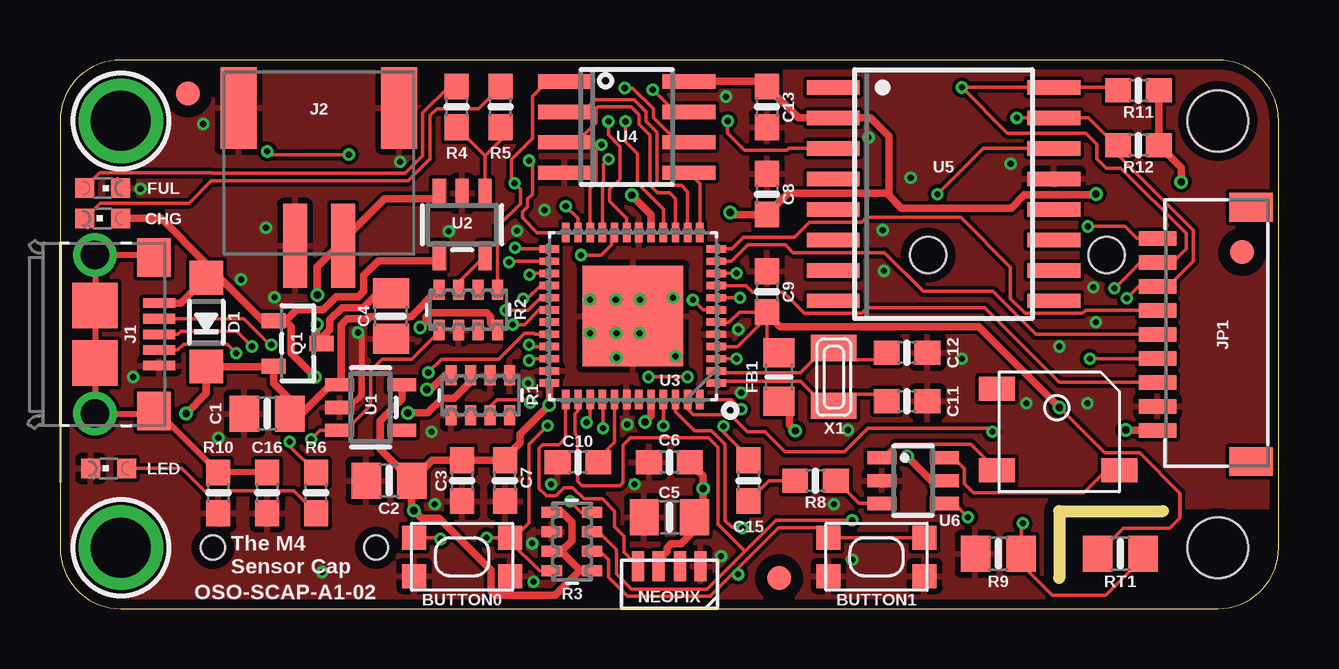
[diagram p2: board, top side]
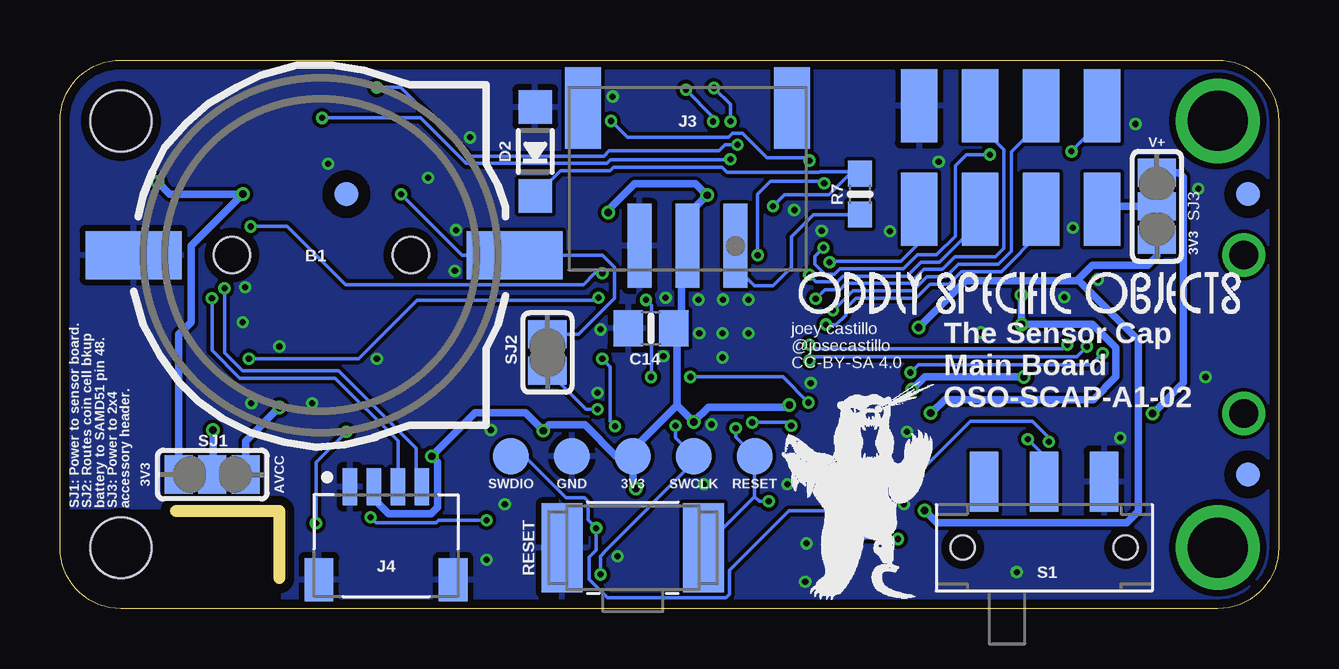
[diagram p3: board, bottom side, seen from below]

Size 50.8 x 22.86 mm. Coordinates in mm from the lower left corner, seen from the top.
Outline: 41.66,1.27 41.66,4.06 45.97,4.06
Outline: 2.54,0 48.26,0 arc90 50.8,2.54 50.8,20.32 arc90 48.26,22.86 2.54,22.86 arc90 0,20.32 0,2.54 arc90 2.54,0
Copper layers (1*16): Top 0.035559375mm / dielectric 1.6mm / Bottom 0.035559375mm
Design rules "oshpark-2layer *": minimum track width 6mil, minimum drill 10mil, track to track 6mil, track to pad 6mil, pad to pad 6mil, via to via 6mil, smd to smd 6mil, copper to edge 15mil, drill to drill 6mil, minimum pad ring 5mil, minimum via ring 5mil, stop-mask expansion 2.5mil, vias tented up to drill 12mil, thermal gap 10mil
Holes 2.54 mm at 48.26,20.32 48.26,2.54
bRestrict: 1 lines
Milling: 2 lines

### Footprints (pad centres in the part's own frame; a part is rotated, then mirrored left to right if it is on the bottom)
CR1220-2 = smd 4 x 2: + 8.29,0; - -7.6,0 | hole 1.5: 3.95,0; -3.5,0
0805-NO = smd 1.24 x 1.5: 1 -0.95,0; 2 0.95,0
0603-NO = smd 1.075 x 1: 1 -0.85,0; 2 0.85,0
0805_10MGAP = smd 1.2 x 1.5: 1 -1.05,0; 2 1.05,0
CHIPLED_0603 = smd 0.8 x 0.8: A 0,-0.75; C 0,0.75
SOD-123 = smd 1.4 x 1.4: A 1.85,0; C -1.85,0
_0805MP = smd 1.2 x 1.3: 1 -1.016,0; 2 1.016,0
FIDUCIAL_1MM = smd 1 x 1: 1 0,0
FCI_10118193-0001LF = smd 0.4 x 1.35: 1 -1.3,2.675; 2 -0.65,2.675; 3 0,2.675; 4 0.65,2.675; 5 1.3,2.675 | smd 1.6 x 1.4: S1 -3.2,2.45; S2 3.2,2.45 | smd 1.9 x 1.9: S3 1.2,0; S4 -1.2,0 | drill 1.2: S5 3.302,0; S6 -3.302,0
JST_S2B-PH-SM4-TB(LF)(SN) = smd 1 x 3.5: 1 -1,0; 2 1,0 | smd 1.5 x 3.4: S1 -3.35,-5.75; S2 3.35,-5.75
JST_S3B-PH-SM4-TB(LF)(SN) = smd 1 x 3.5: 1 2,0; 2 0,0; 3 -2,0 | smd 1.5 x 3.4: P1 -4.35,5.75; P2 4.35,5.75
JST_SM04B-SRSS-TB(LF)(SN) = smd 0.6 x 1.55: 1 -1.5,0; 2 -0.5,0; 3 0.5,0; 4 1.5,0 | smd 1.2 x 1.8: S1 -2.8,-3.875; S2 2.8,-3.875
JST_SH9 = smd 0.6 x 1.55: 1 -4,2.514; 2 -3,2.514; 3 -2,2.514; 4 -1,2.514; 5 0,2.514; 6 1,2.514; 7 2,2.514; 8 3,2.514; 9 4,2.514 | smd 1.2 x 1.8: MT1 -5.3,-1.386; MT2 5.3,-1.386
PINHD_2X4_SMT = smd 1.524 x 3.048: 1 -3.81,-2.159; 2 -3.81,2.159; 3 -1.27,-2.159; 4 -1.27,2.159; 5 1.27,-2.159; 6 1.27,2.159; 7 3.81,-2.159; 8 3.81,2.159
WS2812B_4020 = smd 0.5 x 1.25: 1 1.3,-0.75; 2 0.45,-0.75; 3 -0.45,-0.75; 4 -1.3,-0.75
SOT23-R = smd 0.635 x 1.016: 1 -0.95,-1; 2 0.95,-1; 3 0,1
EXBV8V = smd 0.838 x 0.457: 1 -0.838,1.219; 2 -0.838,0.406; 3 -0.838,-0.406; 4 -0.838,-1.219; 5 0.838,-1.219; 6 0.838,-0.406; 7 0.838,0.406; 8 0.838,1.219
BTN_CK_KSS = smd 1.7 x 3.7: P$1 -2.95,0; P$2 2.95,0
SW_JS102011SAQN = smd 1.2 x 2.5: 1 -2.5,2.75; 2 0,2.75; 3 2.5,2.75 | hole 1: -3.4,0; 3.4,0
SOLDERJUMPER_2WAY_OPEN_NOPASTE = smd 1.168 x 1.6: 1 -1.397,0; 2 0,0; 3 1.397,0
SOLDERJUMPER_REFLOW_NOPASTE = smd 1.168 x 1.6: 1 -0.762,0; 2 0.762,0
BUZZER_SMT_5MM = smd 1.5 x 1: + -2.6,-1.6; - 2.5,-1.6; MT -2.6,1.8
KMR2 = smd 1 x 1: 1 2,0.8; 2 2,-0.8; 3 -2,0.8; 4 -2,-0.8
TESTPOINT_ROUND_1.5MM_NO = smd 1.5 x 1.5: P$1 0,0
SOT23-5 = smd 0.55 x 1.2: 1 -0.95,-1.3; 2 0,-1.3; 3 0.95,-1.3; 4 0.95,1.3; 5 -0.95,1.3
QFN48_7X7MC = smd 0.813 x 0.305: 1 -3.48,2.794; 2 -3.48,2.286; 3 -3.48,1.778; 4 -3.48,1.27; 5 -3.48,0.762; 6 -3.48,0.254; 7 -3.48,-0.254; 8 -3.48,-0.762; 9 -3.48,-1.27; 10 -3.48,-1.778; 11 -3.48,-2.286; 12 -3.48,-2.794; 25 3.48,-2.794; 26 3.48,-2.286; 27 3.48,-1.778; 28 3.48,-1.27; 29 3.48,-0.762; 30 3.48,-0.254; 31 3.48,0.254; 32 3.48,0.762; 33 3.48,1.27; 34 3.48,1.778; 35 3.48,2.286; 36 3.48,2.794 | smd 0.305 x 0.813: 13 -2.794,-3.48; 14 -2.286,-3.48; 15 -1.778,-3.48; 16 -1.27,-3.48; 17 -0.762,-3.48; 18 -0.254,-3.48; 19 0.254,-3.48; 20 0.762,-3.48; 21 1.27,-3.48; 22 1.778,-3.48; 23 2.286,-3.48; 24 2.794,-3.48; 37 2.794,3.48; 38 2.286,3.48; 39 1.778,3.48; 40 1.27,3.48; 41 0.762,3.48; 42 0.254,3.48; 43 -0.254,3.48; 44 -0.762,3.48; 45 -1.27,3.48; 46 -1.778,3.48; 47 -2.286,3.48; 48 -2.794,3.48 | smd 4.191 x 4.191: 49 0,0
MICROBUILDER_SOIC8_150MIL = smd 0.6 x 2.2: 1 -1.905,-2.6; 2 -0.635,-2.6; 3 0.635,-2.6; 4 1.905,-2.6; 5 1.905,2.6; 6 0.635,2.6; 7 -0.635,2.6; 8 -1.905,2.6
SO16W = smd 0.6 x 2.2: 1 -4.445,-4.6; 2 -3.175,-4.6; 3 -1.905,-4.6; 4 -0.635,-4.6; 5 0.635,-4.6; 6 1.905,-4.6; 7 3.175,-4.6; 8 4.445,-4.6; 9 4.445,4.6; 10 3.175,4.6; 11 1.905,4.6; 12 0.635,4.6; 13 -0.635,4.6; 14 -1.905,4.6; 15 -3.175,4.6; 16 -4.445,4.6
SOT23-6 = smd 0.55 x 1.2: 1 -0.95,-1.3; 2 0,-1.3; 3 0.95,-1.3; 4 0.95,1.3; 5 0,1.3; 6 -0.95,1.3
MOUNTINGHOLE_2.5_PLATED = drill 2.5 pad 3.2: P$1 0,0
XTAL3215 = smd 1.1 x 1.9: P$1 1.2,0; P$2 -1.2,0

### Placement (x,y rotation side)
B1  40.13,14.73 0 bottom
C1  8.64,8.13 180 top
C2  13.72,5.33 180 top
C3  16.76,5.33 270 top
C4  13.79,12.19 270 top
C5  25.4,3.81 0 top
C6  25.4,6.1 0 top
C7  18.54,5.33 90 top
C8  29.46,17.27 270 top
C9  29.46,13.21 270 top
C10  21.59,6.1 0 top
C11  35.31,8.64 0 top
C12  35.31,10.67 0 top
C13  29.46,20.9 270 top
C14  26.16,11.68 180 bottom
C15  28.7,5.33 270 top
C16  8.64,4.83 270 top
CHG  1.78,16.26 90 top
D1  6.1,11.94 90 top
D2  30.99,19.05 90 bottom
FB1  29.97,9.65 90 top
FID1  5.33,21.46 90 top
FID2  49.28,14.86 270 top
FID3  29.97,1.27 90 top
FID4  1.27,5.59 270 bottom
FID5  1.27,17.27 0 bottom
FID6  38.86,17.27 0 bottom
FUL  1.78,17.53 270 top
J1  1.46,11.43 270 top
J2  10.79,15.11 180 top
J3  24.64,15.11 0 bottom
J4  37.21,5.08 0 bottom
JP1  48.26,11.43 90 top
JP2  11.18,18.8 0 bottom
LED  2.03,5.84 90 top
NEOPIX  25.4,1.02 180 top
Q1  9.91,11.05 270 top
R1  17.53,8.89 90 top
R2  17.02,12.45 90 top
R3  21.34,2.79 0 top
R4  16.54,20.9 270 top
R5  18.36,20.9 90 top
R6  10.67,4.83 270 top
R7  17.45,17.27 90 bottom
R8  31.5,5.33 0 top
R9  39.12,2.29 180 top
R10  6.6,4.83 270 top
R11  44.96,21.59 0 top
R12  44.96,19.3 0 top
RESET  26.92,2.54 0 bottom
RT1  44.2,2.29 0 top
S1  9.78,2.54 0 bottom
SJ1  44.45,5.59 0 bottom
SJ2  30.48,10.67 90 bottom
SJ3  5.08,16.76 270 bottom
SP1  41.66,7.37 0 top
SW1  16.76,2.16 0 top
SW2  34.04,2.16 0 top
TP1  32,6.35 0 bottom
TP2  29.46,6.35 0 bottom
TP3  26.92,6.35 0 bottom
TP4  24.38,6.35 0 bottom
TP5  21.84,6.35 0 bottom
U1  12.95,8.38 270 top
U2  16.76,16 180 top
U3  23.88,12.19 180 top
U4  23.62,20.07 270 top
U5  36.83,17.27 270 top
U6  35.56,5.33 270 top
U$1  2.54,20.32 90 top
U$4  2.54,2.54 90 top
U$31  [OSO_WORDMARK_ONELINE_725MIL_1000DPI]  20.07,12.19 0 bottom
U$32  [OSO_BEAR_250X360MIL_1000DPI]  17.53,4.95 0 bottom
X1  32.26,9.65 90 top

### Tracks (layer width: path | path; a pad name or v marks a point on that pad's centre or on a via)
!RESET  (via drill 0.25)
  Top 0.152: R3.8 21.72,4.01 v21.26,4.47 | U3.40 22.63,8.69 v22.63,7.52
  Bottom 0.152: v22.63,7.52 22.63,7.14 TP5.P$1 21.84,4.67 | RESET.P$2 21.84,4.67 | v21.26,4.47 21.64,4.47 21.84,4.67
+3V3  (via drill 0.3)
  Top 0.305: U1.5 14.25,8.74 13.35,7.83 13.35,6.65 C2.1 | U3.36 v20.4,8.49 19.18,7.27 19.18,6.92 18.54,6.28 C7.2 C3.1 15.52,6.18 C2.1 | C2.1 14.67,4.17 v14.75,4.08 15.07,3.76 15.79,3.76 17.96,1.6 17.96,0.73 18.14,0.55 20.63,0.55 21.65,1.57 21.7,1.57 | R3.5 21.7,1.57 | 21.7,1.57 20.89,2.39 | R2.4 17.96,11.89 17.96,12.15 17.78,12.33 15.44,12.33 15.27,12.15 15.27,11.96 v15.01,11.71 | U3.44 24.64,8.04 v24.38,7.78 | v35.31,6.35 36.32,5.33 U6.5 | U3.17 24.64,16.42 v23.83,17.23 | FB1.1 30.4,8.21 30.4,7.67 v30.65,7.41 | v43.18,17.27 43.15,17.24 40.2,17.24 39.66,16.69 35.08,16.69 34.47,17.3 | NEOPIX.2 24.95,2.02 25.3,2.37 25.3,2.52 25.47,2.7 25.88,2.7 26.45,3.27 C5.2 26.81,4.17 v26.81,5 26.81,5.54 C6.2 | 20.89,2.39 21.34,2.83 21.34,3.61 20.93,4.01 R3.1 | R3.3 20.89,2.39 | 34.47,17.3 34.54,17.3 34.54,19.68 33.78,20.45 U5.2 30.77,20.45 C13.1 29.25,21.97 U4.8 | v27.94,16.51 28.03,16.42 C8.2 30.34,17.3 34.47,17.3 | R11.2 R12.2 46.74,18.38 v46.74,17.78
  Bottom 0.305: v15.01,11.71 13.06,13.66 8.41,13.66 | v14.75,4.08 14.24,3.57 6.33,3.57 5.84,4.06 5.84,11.18 8.33,13.66 8.41,13.66 | 25.09,8.48 v24.39,7.78 v24.38,7.78 23.77,8.39 20.49,8.39 v20.4,8.49 | 25.09,8.48 25.09,11.56 C14.1 24.89,12 24.89,15.33 24.86,15.33 J3.2 24.64,16.42 v23.83,17.23 24.3,17.7 26.85,17.7 27.94,16.61 v27.94,16.51 | TP3.P$1 27.62,6.35 28.92,7.66 30.41,7.66 v30.65,7.41 31.4,8.16 33.49,8.16 v35.31,6.35 35.05,6.1 35.05,4.23 35.32,3.96 37.11,3.96 37.64,4.5 37.64,5.03 J4.2 | SJ1.1 45.85,11.43 45.34,11.94 45.34,15.11 v43.18,17.27 46.23,17.27 v46.74,17.78 | v26.81,5 26.92,5.12 TP3.P$1 | TP3.P$1 26.92,6.64 25.09,8.48 | SJ3.3 5.08,14.68 5.46,14.3 7.77,14.3 8.41,13.66
_STEMMA
  Bottom 0.152: J3.1 22.64,14.26 21.84,13.46 21.08,13.46 20.32,14.22 20.32,15.49 19.39,16.42 R7.1
_VBACKUP  (via drill 0.25)
  Top 0.152: U3.48 27.99,8.71 v28.4,8.31
  Bottom 0.152: SJ2.1 28.88,8.31 v28.4,8.31
A0  (via drill 0.25)
  Top 0.152: JP1.9 44.9,15.43 44.39,15.94 43.13,15.94 43.12,15.92 v42.85,15.92 | U3.10 v28.19,13.97
  Bottom 0.152: v28.19,13.97 28.52,13.97 28.98,13.5 38.9,13.5 41.32,15.92 v42.85,15.92
A1
  Top 0.152: U3.12 28.01,14.99 28.49,15.47 30.23,15.47 30.61,15.47 31.25,16.11 33.42,16.11 33.62,16.3 37.55,16.3 39.62,14.22 39.62,12.91 40.23,12.3 42.62,12.3 42.76,12.43 JP1.6
A2
  Top 0.152: U3.11 27.98,14.48 28.67,15.16 30.23,15.16 30.56,14.84 34.37,14.84 35.99,13.22 38.88,13.22 40.67,11.43 JP1.5
ACC_EN  (via drill 0.25)
  Top 0.152: U3.27 19.63,13.97 v19.57,13.91
  Bottom 0.152: v19.57,13.91 19.28,13.62 18.39,13.62 18.16,13.86 15.51,13.86 14.92,14.44 14.13,14.44 12.6,15.98 12.45,15.98 JP2.3
ACC_IO0  (via drill 0.25)
  Top 0.152: U3.29 20.02,12.95 19.5,12.43 v18.58,12.43
  Bottom 0.152: v18.58,12.43 18.56,12.43 17.74,13.25 15.26,13.25 14.67,13.83 13.88,13.83 13.36,14.35 11.69,14.35 11.15,14.89 11.15,19.04 9.91,20.29 JP2.6
ACC_IO1  (via drill 0.25)
  Top 0.152: U3.28 20.02,13.46 19.48,12.92 v19.3,12.92
  Bottom 0.152: v19.3,12.92 18.92,13.3 18.29,13.3 18.04,13.55 15.38,13.55 14.8,14.13 14.01,14.13 13.49,14.66 11.82,14.66 11.46,15.02 11.46,19.12 12.45,20.11 JP2.4
ACC_POWER
  Bottom 0.305: JP2.7 7.37,16.21 6.81,16.76 SJ3.2 5.08,18.29
ACC_RST  (via drill 0.25)
  Top 0.152: U3.30 19.97,12.45 19.36,11.84 v18.87,11.84
  Bottom 0.152: v18.87,11.84 18.45,11.84 18.05,12.23 18.05,12.51 17.62,12.94 15.13,12.94 14.55,13.53 13.76,13.53 13.24,14.05 11.56,14.05 9.91,15.7 JP2.5
AUDIO  (via drill 0.25)
  Top 0.152: U3.3 v28.19,10.41 | v27.66,7.59 27.66,7.35 28.7,6.31 C15.1
  Bottom 0.152: v28.19,10.41 27.86,10.08 27.86,7.8 v27.66,7.59
AVCC  (via drill 0.3)
  Top 0.152: RT1.1 44.31,3.35 46.27,3.35 46.69,3.77 46.69,4.81 45,6.5 43.54,6.5 v41.66,8.38 | U3.4 28.24,10.92 29.46,12.14 | U3.6 27.89,11.94 28.31,12.36 C9.2 29.46,12.14 | FB1.2 29.46,11.18 29.46,12.14
  Top 0.305: v41.66,8.38 38.3,11.74 30.02,11.74 29.46,12.3 C9.2
  Bottom 0.305: v41.66,8.38 43.05,6.99 SJ1.3
BATMON  (via drill 0.25)
  Top 0.152: v26.38,12.86 26.8,12.45 U3.7 | v26.16,9.65 v24.53,9.65 | v19.61,8.59 19.48,8.71 18.21,8.71 17.93,8.44 R1.3 R1.2
  Bottom 0.152: v26.16,9.65 26.15,9.66 26.15,12.63 v26.38,12.86 | v19.61,8.59 20.67,9.65 v24.53,9.65
BTN0  (via drill 0.25)
  Top 0.152: SW1.1 18.76,2.79 19.98,1.57 R3.4 | U3.39 22.1,7.91 v21.95,7.76 | v20.32,7.62 19.56,6.86 19.56,3.59 18.93,2.96 SW1.1 | SW1.3 15.81,2.96 v15.87,2.9 | v17.78,2.96 SW1.1
  Bottom 0.152: v21.95,7.76 20.46,7.76 v20.32,7.62 | v17.78,2.96 15.93,2.96 v15.87,2.9
D0  (via drill 0.25)
  Top 0.152: JP1.4 45.73,10.41 v42.93,10.41 | v28.35,12.95 U3.8
  Bottom 0.152: v42.93,10.41 38.35,10.41 35.92,12.85 28.45,12.85 v28.35,12.95
D1
  Top 0.152: U3.9 28.59,13.46 28.87,13.18 30.16,13.18 31.04,12.3 33.42,12.3 33.66,12.53 38.55,12.53 41.66,9.43 JP1.3
EN  (via drill 0.25)
  Top 0.152: R2.1 15.8,11.53 14.66,10.39 13.44,10.39 12.95,9.91 12.95,8.48 11.9,7.43 U1.3 10.84,7.43 v10.46,7.06
  Bottom 0.152: S1.2 9.78,6.38 v10.46,7.06
GND  (via drill 0.25)
  Top 0.254: U1.2 12.04,8.38 12.57,8.91 12.57,11.35 v12.42,11.51
  other vias: 22.1,11.48 37.59,10.41 41.66,10.92 42.82,8.56 10.92,1.52 6.6,7.11 15.49,7.37 19.51,9.4 33.02,2.03 27.56,2.18 40.28,8.56 43.08,13.39 35.46,17.96 28.27,11.63 34.34,14.07 28.4,8.99 32.84,7.44 32.26,4.34 3.05,9.65 5.97,20.19 19.05,15.75 39.62,18.54 19.74,1.12 15.62,4.34 20.47,5.18 20.19,16.61 16.21,15.72 8.59,15.88 8.94,12.98 23.95,5.18 23.65,7.67 34.29,15.77 25.55,12.95 25.65,10.52 27.76,21.34 33.71,19.63 23.19,11.48 23.16,12.88 22.1,12.88 24.18,12.88 24.16,11.48 23.19,10.46 7.54,13.72 14.17,18.62 19.68,2.72 43.18,11.94 3.35,17.5
  pour Bottom (rank 6): 57.15,-1.02 57.15,23.88 -1.52,23.88 -1.52,1.27 0.76,-1.02
  pour Top: 58.17,-2.05 58.17,24.64 -2.78,24.64 -2.78,-2.05
  cutout Top: 41.66,4.06 51.31,4.06 51.31,-0.25 41.66,-0.25
  cutout Bottom: 51.31,4.06 41.66,4.06 41.66,-0.25 51.31,-0.25
N$2
  Top 0.152: LED.A 5.08,5.84 6.01,4.91 9.73,4.91 R6.2
N$3
  Top 0.152: C15.2 29.51,5.29 29.55,5.33 R8.1
N$4
  Top 0.152: R8.2 33.3,4.38 U6.3
N$6
  Top 0.152: CHG.C 1.67,16.9 5.39,16.9 6.31,17.82 14.5,17.82 15.44,18.75 15.44,20.55 15.72,20.83 17.44,20.83 R5.2
N$7
  Top 0.152: FUL.A 1.66,18.16 6.33,18.16 6.34,18.14 14.39,18.14 15.12,18.87 15.12,20.67 16.21,21.75 R4.1
NEOPIX
  Top 0.152: NEOPIX.1 23.52,2.35 23.52,3.01 23.11,3.41 23.11,4.06 22.61,4.57 21.84,4.57 21.37,5.05 21.02,5.05 20.67,4.7 20.27,4.7 19.97,5 19.97,6.69 20.11,6.83 20.8,6.83 21.08,7.11 U3.37
POWER_OUT  (via drill 0.3)
  Top 0.305: JP1.1 44.44,7.43 v44.42,7.44
  Bottom 0.305: v44.42,7.44 44.42,5.61 SJ1.2 45.97,5.59
PROG
  Top 0.152: U2.5 16.61,13.6 R2.7
QSPI_CS  (via drill 0.25)
  Top 0.152: R2.5 18.24,15.93 19.19,16.88 19.19,17.48 v18.95,17.73 18.82,17.86 18.82,18.72 19.69,19.59 19.69,21.35 20.32,21.97 U4.1 | U3.20 22.99,15.54 22.99,15.17 22.55,14.73 v21.72,14.73
  Bottom 0.152: v21.72,14.73 21.72,17.27 21.18,17.81 19.02,17.81 v18.95,17.73
QSPI_DATA[0]
  Top 0.152: U3.13 26.67,17.71 U4.5
QSPI_DATA[1]
  Top 0.152: U4.2 21.78,20.7 22.29,21.21 23.92,21.21 24.43,20.7 24.43,20.31 24.89,19.85 24.89,17.77 25.03,17.63 25.91,17.63 26.16,17.38 U3.14
QSPI_DATA[2]
  Top 0.152: U3.15 25.65,17.07 25.4,17.33 24.9,17.33 24.59,17.64 24.59,19.72 24.12,20.19 24.12,20.57 23.8,20.9 22.42,20.9 22.35,20.84 22.35,20.25 21.53,19.43 U4.3
QSPI_DATA[3]  (via drill 0.25)
  Top 0.152: U4.7 25.63,20.7 v24.71,21.62 | U3.16 25.15,16.65 24.08,17.72 24.08,18.95 23.57,19.46 v23.57,20.3
  Bottom 0.152: v24.71,21.62 23.57,20.48 v23.57,20.3
QSPI_SCK  (via drill 0.25)
  Top 0.152: U4.6 25.75,19.43 24.73,20.45 24.73,20.83 23.87,21.69 v23.54,21.69 | U3.19 23.62,16.26 22.91,16.97 22.91,17.46 23.34,17.9 23.34,19.25 22.86,19.74 v22.86,20.3
  Bottom 0.152: v23.54,21.69 22.86,21.01 v22.86,20.3
RTC_INT  (via drill 0.25)
  Top 0.152: v19.55,18.67 19.69,18.53 19.69,17.27 19.5,17.07 19.5,16.75 19.28,16.54 19.28,16.28 19.89,15.67 U3.24 | U5.3 30.38,19.18 30.31,19.11 28.54,19.11 27.83,19.81 v27.83,20.32
  Bottom 0.152: v27.83,20.32 27.15,19.63 22.94,19.63 22.77,19.81 22.35,19.81 21.34,18.8 19.68,18.8 v19.55,18.67
RX  (via drill 0.25)
  Top 0.152: U3.26 18.77,14.48 v18.72,14.43
  Bottom 0.152: v18.72,14.43 18.67,14.48 15.75,14.48 14.99,15.24 JP2.1
SCL  (via drill 0.25)
  Top 0.152: U3.22 22.1,17.51 22.35,17.77 22.35,19.11 v22.57,19.33 | v43.94,13.35 44.12,13.53 44.13,13.53 44.84,14.23 44.84,14.24 45.02,14.43 JP1.8 46.38,14.43 46.94,14.99 46.94,15.63 44.22,18.36 43.62,18.36 43.23,18.75 43.23,19.35 42.76,19.81 39.5,19.81 v37.59,21.72 U5.16 43.98,21.72 R11.1
  Bottom 0.152: v37.59,21.72 36.6,21.72 33.74,18.86 28.13,18.86 27.91,19.07 23.33,19.07 23.07,19.33 v22.57,19.33 | J4.4 35.97,5.33 35.97,6.68 39.2,9.91 43.18,9.91 43.94,10.67 v43.94,13.35
SDA  (via drill 0.25)
  Top 0.152: v22.86,18.73 22.66,18.52 22.66,17.64 22.61,17.59 U3.21 | v39.88,20.45 U5.15 42.87,20.45 44.01,19.3 R12.1 44.11,18.9 47.24,15.76 47.24,14.48 46.2,13.43 JP1.7 44.96,13.43 v44.47,12.94
  Bottom 0.152: v22.86,18.73 22.86,18.7 27.86,18.7 28,18.55 33.87,18.55 35.76,20.45 v39.88,20.45 | J4.3 36.71,6.99 39.32,9.6 43.31,9.6 44.47,10.76 v44.47,12.94
SHIELD
  Top 0.254: J1.S1 3.81,14.73 J1.S6 J1.S4 J1.S3 J1.S5 3.81,8.13 J1.S2 4.05,8.23 R10.1 C16.1
SPK_EN  (via drill 0.25)
  Top 0.152: R3.7 22.45,3.2 23.19,2.46 23.19,1.45 23.82,0.81 26.97,0.81 28.55,2.39 | 28.55,2.39 29.84,3.69 v33.02,3.69 | U3.38 21.59,8.26 21.46,8.13 21.46,7.28 21.57,7.17 21.57,5.3 21.75,5.12 23.34,5.12 23.47,5.25 23.47,6.81 23.77,7.11 27.03,7.11 27.42,6.72 27.42,3.52 28.55,2.39 | v37.85,3.81 37.27,4.38 U6.4
  Bottom 0.152: v33.02,3.69 35.02,3.69 35.12,3.58 37.62,3.58 v37.85,3.81
SPK_N
  Top 0.152: SP1.+ 37.96,6.86 34.83,6.86 U6.1
SPK_P
  Top 0.152: SP1.- 43.61,5.77 42.67,4.83 38.06,4.83 37.69,5.2 37.69,5.83 37.23,6.28 U6.6
STAT
  Top 0.152: R4.2 17.71,18.88 | 17.71,18.88 U2.1 | R5.1 18.36,19.53 17.71,18.88
STEMMA  (via drill 0.25)
  Top 0.152: U3.23 21.59,16.26 v21.08,16.76
  Bottom 0.152: v21.08,16.76 20.6,17.25 18.75,17.25 17.87,18.12 R7.2 17.54,18.21 19.15,18.21 19.17,18.19 23,18.19 23.21,18.4 27.73,18.4 27.88,18.25 29.94,18.25 D2.C
SWCLK_BTN1  (via drill 0.25)
  Top 0.152: R3.6 22.5,2.39 22.86,2.03 22.86,1.3 23.65,0.51 27.1,0.51 28.01,1.43 v28.27,1.43 28.27,1.68 29.95,3.37 31.63,3.37 SW2.3 SW2.1 | U3.45 v25.15,7.62
  Bottom 0.152: v25.15,7.62 25.15,7.11 TP4.P$1 24.38,6.1 28.14,2.34 28.14,2.31 28.27,2.19 v28.27,1.43
SWDIO_LED  (via drill 0.25)
  Top 0.152: U3.46 25.65,8.21 26.44,7.42 27.15,7.42 27.72,6.85 27.72,3.67 28,3.39 28.41,3.39 v28.45,3.36 | v9.58,6.96 9.6,6.94 9.6,6.74 R6.1
  Bottom 0.152: TP1.P$1 31.44,6.35 29.71,4.62 28.93,4.62 28.8,4.49 28.8,3.71 v28.45,3.36 28.45,2.44 28.75,2.13 28.75,1.23 27.99,0.46 23.03,0.46 22.89,0.59 22.89,1.6 20.42,4.08 16.57,4.08 12.85,7.8 10.26,7.8 9.58,7.11 v9.58,6.96
TS  (via drill 0.25)
  Top 0.152: v40.13,3.56 40.07,3.49 R9.1 40.07,1.85 41.36,0.56 43.59,0.56 45.15,2.11 RT1.2 | v38.86,7.37 38.71,7.52 33.68,7.52 32.69,6.53 30.23,6.53 29.39,7.36 28.66,7.36 27.94,8.08 26.42,8.08 26.16,8.33 U3.47
  Bottom 0.152: v40.13,3.56 40.13,6.1 v38.86,7.37
TX  (via drill 0.25)
  Top 0.152: U3.25 19.02,14.99 v18.97,15.04 | v8.64,19.05 8.77,18.92 v12.04,18.92
  Bottom 0.152: v18.97,15.04 v18.97,15.03 19.33,14.68 19.33,14.35 18.91,13.93 18.52,13.93 18.29,14.16 15.63,14.16 15.05,14.74 14.26,14.74 13.49,15.52 13.49,18.46 13.03,18.92 v12.04,18.92 | JP2.8 7.37,20.32 v8.64,19.05
USB_N  (via drill 0.25)
  Top 0.152: v19.56,11 19.63,10.92 U3.33 | v8.81,11 8.74,11 7.66,12.08 J1.2
  Bottom 0.152: v19.56,11 19.38,10.82 8.99,10.82 v8.81,11
USB_P  (via drill 0.25)
  Top 0.152: v19.56,10.34 19.63,10.41 U3.34 | v8,10.92 7.37,11.56 5.02,11.56 4.9,11.43 J1.3
  Bottom 0.152: v19.56,10.34 19.54,10.34 19.38,10.5 8.42,10.5 v8,10.92
USBID  (via drill 0.25)
  Top 0.152: v15.35,9.84 15.91,10.4 18.28,10.4 19.36,11.48 19.76,11.48 19.81,11.43 U3.32 | J1.4 4.91,10.78 5.15,11.02 6.97,11.02 v7.34,10.65
  Bottom 0.152: v7.34,10.65 7.82,10.17 15.02,10.17 v15.35,9.84
V+  (via drill 0.3)
  Top 0.305: R2.8 15.75,13.28 14.63,12.17 12.92,12.17 12.83,12.09 11.97,12.09 11.72,11.84 11.72,9.4 U1.1 11.28,9.33 10.07,8.13 C1.1 9.59,8.71 8.91,9.39 Q1.2 8.89,10.09 D1.C 6.1,8.97 v5.26,8.13
  Bottom 0.305: SJ3.1 4.15,18.16 3.98,17.98 3.98,9.41 v5.26,8.13
VBACKUP  (via drill 0.25)
  Top 0.152: U5.14 38.48,19.18 v36.58,17.27
  Bottom 0.152: v36.58,17.27 34.04,14.73 B1.+ 28.19,14.73 27.69,14.22 27.69,12.93 29.19,11.43 SJ2.2
VBAT  (via drill 0.3)
  Top 0.305: C4.1 13.24,13.14 12.64,12.54 11.75,12.54 11.24,12.03 11.24,11.62 10.91,11.29 Q1.3 10.69,11.26 10.69,11.82 v10.72,11.85 | R1.7 17.12,9.46 16.43,8.78 15.95,8.78 15.33,8.15 v14.5,8.15 | v10.73,13.07 10.73,14.25 11.59,15.11 J2.1 11.79,15.35 13.53,17.08 15.6,17.08 U2.3
  Bottom 0.305: v10.72,11.85 v10.73,11.86 | v14.5,8.15 14.48,8.15 13.92,8.71 7.73,8.71 6.79,9.65 6.79,10.88 7.76,11.86 v10.73,11.86 | v10.73,11.86 v10.73,13.07
VBUS  (via drill 0.3)
  Top 0.305: J1.1 5.04,12.73 D1.A | Q1.1 8.45,12 6.66,13.79 D1.A | U2.4 15.61,14.5 13.27,14.5 12.66,13.89 12.66,13.22 12.44,13 11.51,13 10.97,12.46 9.87,12.46 9.41,12 Q1.1 | v10.62,9.65 9.63,10.65 9.63,11.74 9.37,12 Q1.1 | v15.29,9.13 15.46,9.13 16.05,9.73 R1.8 | D1.A 6.1,14.38 4.22,16.26 CHG.A
  Bottom 0.305: v15.29,9.13 15.27,9.13 14.75,9.65 v10.62,9.65
VDDCORE
  Top 0.152: U3.41 23.11,6.92 22.44,6.25 C10.2
XIN32
  Top 0.152: U3.1 27.43,9.47 30.86,9.47 31.88,8.45 X1.P$2 32.74,8.94 34.06,8.94 34.36,8.64 C11.1
XOUT32
  Top 0.152: U3.2 27.43,9.83 30.86,9.83 31.88,10.85 X1.P$1 32.74,10.37 34.16,10.37 C12.1

### Text on the board
tPlace: The M4 / Sensor Cap | OSO-SCAP-A1-02 | BUTTON0 | BUTTON1
bPlace: V+ | 3V3 | joey castillo / @josecastillo / CC-BY-SA 4.0 | The Sensor Cap / Main Board / OSO-SCAP-A1-02 | AVCC | 3V3 | RESET | SWCLK | 3V3 | GND | SWDIO | SJ1: Power to sensor board. / SJ2: Routes coin cell bkup / battery to SAMD51 pin 48. / SJ3: Power to 2x4 / accessory header.